# EAGLE schematic EEZ DIB DCP405 r2B5 (EAGLE 7.2.0)
TPS54060 bias, PNP pass (vertical)
Assembly variants: Farnell, TME

## Sheet 1 of 6: Power pre-regulator
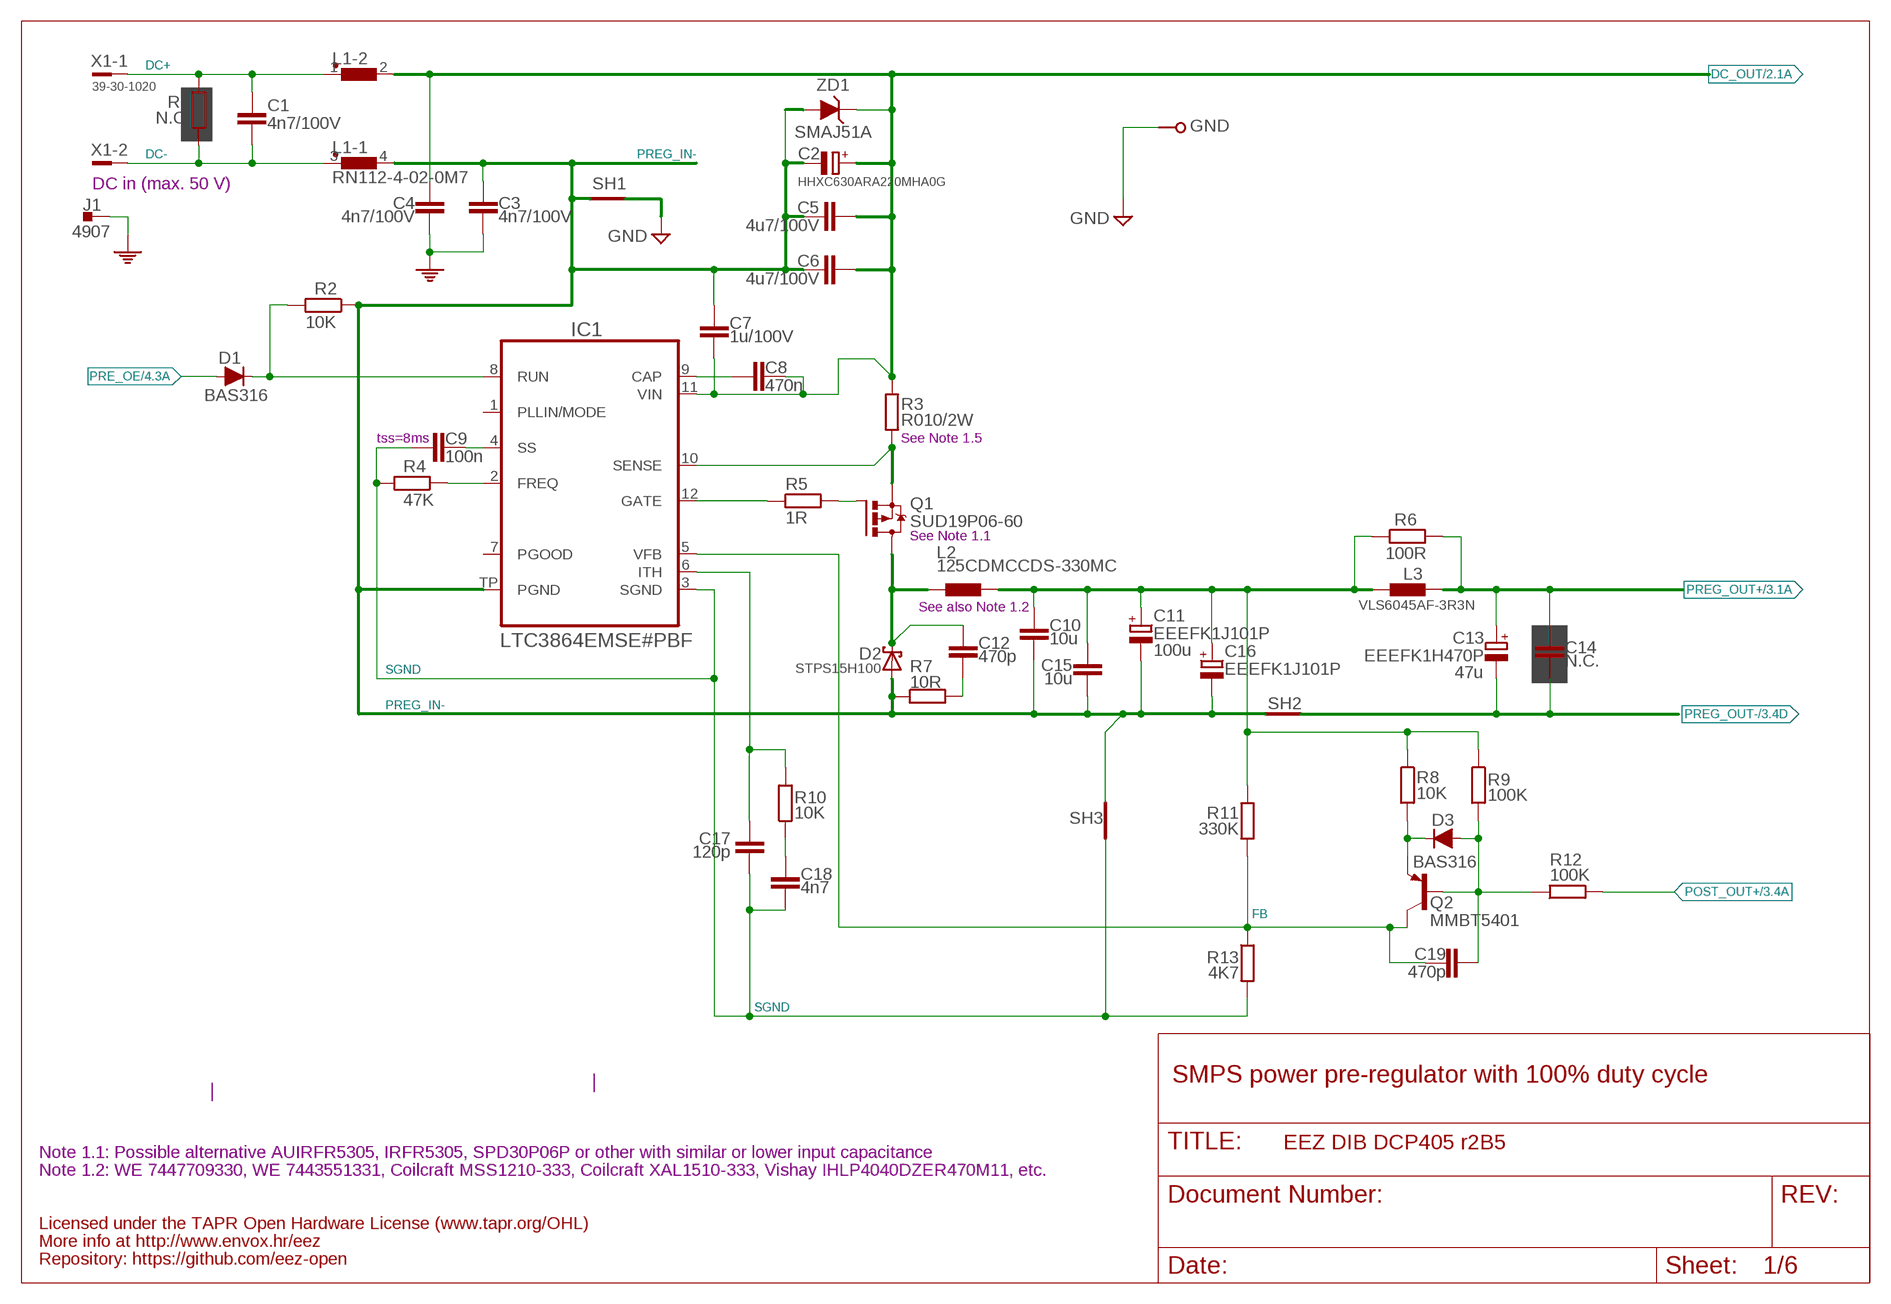
[diagram p0: schematic, sheet 1]

### Parts
C1  4n7/100V  C-EUC1206  [C1206]
C2  HHXC630ARA220MHA0G  ECAPSMD8.3MM/HA0  [CAPAE830X1050N]
C3  4n7/100V  C-EUC1206  [C1206]
C4  4n7/100V  C-EUC1206  [C1206]
C5  4u7/100V  C-EUC1210  [C1210]
C6  4u7/100V  C-EUC1210  [C1210]
C7  1u/100V  C-EUC1206  [C1206]
C8  470n  C-EUC0805  [C0805]
C9  100n  C-EUC0603  [C0603]
C10  10u  C-EUC1210  [C1210]
C11  EEEFK1J101P  ECAP10X10  [CAPAE1030X1050N]
C12  470p  C-EUC0805  [C0805]
C13  EEEFK1H470P  ECAPSMD8.3MM/HA0  [CAPAE830X1050N]
C14  N.C.  C-EUC0805  [C0805]
C15  10u  C-EUC1210  [C1210]
C16  EEEFK1J101P  ECAP10X10  [CAPAE1030X1050N]
C17  120p  C-EUC0805  [C0805]
C18  4n7  C-EUC0805  [C0805]
C19  470p  C-EUC0805  [C0805]
D1  BAS316  DIODESOD323R  [SOD323-R]
D2  STPS15H100  SCHOTTKY-DUAL_A_L  [TO252-L]
D3  BAS316  DIODESOD323R  [SOD323-R]
GND  PCB_TEST_TABSHIELD  [PCB_SHIELD_TAB]
IC1  LTC3864EMSE#PBF  LTC3864  [LTC_05-08-1666]
J1  4907  PCB_TAB-4907  [PCB_TAB-4907]
L1  RN112-4-02-0M7  RN112  [RN112]
L2  125CDMCCDS-330MC  125CDMCC/DS  [125CDMCC/DS]
L3  VLS6045AF-3R3N  COILCRAFT_HPI0630  [COILCRAFT_HPI0630]
Q1  SUD19P06-60  P-MOSFETDPAK  [TO229P990X239-3N]
Q2  MMBT5401  BC857B-PNP-SOT23-BEC  [SOT23-BEC]
R1  N.C.  R-EU_R2512  [R2512]
R2  10K  R-EU_R0805  [R0805]
R3  R010/2W  R-EU_R2512  [R2512]
R4  47K  R-EU_R0805  [R0805]
R5  1R  R-EU_R0805  [R0805]
R6  100R  R-EU_R0805  [R0805]
R7  10R  R-EU_R1206  [R1206]
R8  10K  R-EU_R0805  [R0805]
R9  100K  R-EU_R0805  [R0805]
R10  10K  R-EU_R0805  [R0805]
R11  330K  R-EU_R0805  [R0805]
R12  100K  R-EU_R0805  [R0805]
R13  4K7  R-EU_R0805  [R0805]
SH1  SHORTNOHOLE  [SHORT_NOHOLE]
SH2  Pgnd to Pout- short  SHORTNOHOLE  [SHORT_NOHOLE]
SH3  Sgnd to Pgnd short  SHORTNOHOLE  [SHORT_NOHOLE]
X1  39-30-1020  MINIFIT_39301020  [MINIFIT_39301020]
ZD1  SMAJ51A  P6SMB68A  [DO214AA]

### Nets
DC+: C1.2 L1.1 R1.2 X1.1
DC-: C1.1 L1.3 R1.1 X1.2
DC_OUT: C2.+ C4.2 C5.1 C6.1 C7.1 C8.2 IC1.11(VIN) L1.2 R3.1 ZD1.C ; also sheet 2
FB: C19.1 IC1.5(VFB) Q2.C R11.2 R13.1
GND: GND.1 SH1.2(GND_B) ; also sheet 2,3,4,5,6
L_OUT: C10.1 C11.+ C15.1 C16.+ L2.2 L3.1 R6.1 R8.1 R9.1 R11.1
N$1: D3.C Q2.E R8.2
N$2: C18.1 R10.1
N$7: D1.C IC1.8(RUN) R2.2
N$8: C17.1 IC1.6(ITH) R10.2
N$23: C8.1 IC1.9(CAP)
N$24: IC1.2(FREQ) R4.1
N$27: C9.2 IC1.4(SS)
N$28: Q1.1(G) R5.2
N$30: IC1.12(GATE) R5.1
N$38: C12.2 R7.2
N$79: C19.2 D3.A Q2.B R9.2 R12.1
PE: C3.2 C4.1 J1.1 J1.2 ; also sheet 6
POST_OUT+: R12.2 ; also sheet 3,6
PRE_OE: D1.A ; also sheet 4
PREG_IN-: C2.- C3.1 C5.2 C6.2 C7.2 C10.2 C11.- C15.2 C16.- D2.1(A) D2.2(A) IC1.TP(PGND) L1.4 R2.1 R7.1 SH1.1(GND_A) SH2.2(GND_B) SH3.2(GND_B) ZD1.A
PREG_OUT+: C13.+ C14.1 L3.2 R6.2 ; also sheet 3
PREG_OUT-: C13.- C14.2 SH2.1(GND_A) ; also sheet 3,5
SENSE: IC1.10(SENSE) Q1.3(S) R3.2
SGND: C9.1 C17.2 C18.2 IC1.3(SGND) R4.2 R13.2 SH3.1(GND_A)
SW: C12.1 D2.3(C) L2.1 Q1.2(D)
Unconnected: IC1.1(PLLIN/MODE) IC1.7(PGOOD)

### Notes on the sheet
- DC in (max. 50 V)
- tss=8ms | See Note 1.5
- See Note 1.1
- See also Note 1.2
- 100u
- 47u
- SMPS power pre-regulator with 100% duty cycle
- Note 1.1: Possible alternative AUIRFR5305, IRFR5305, SPD30P06P or other with similar or lower input capacitance
- Note 1.2: WE 7447709330, WE 7443551331, Coilcraft MSS1210-333, Coilcraft XAL1510-333, Vishay IHLP4040DZER470M11, etc.
- Licensed under the TAPR Open Hardware License (www.tapr.org/OHL)
- More info at http://www.envox.hr/eez
- Repository: https://github.com/eez-open

## Sheet 2 of 6: Bias power, DIB interface
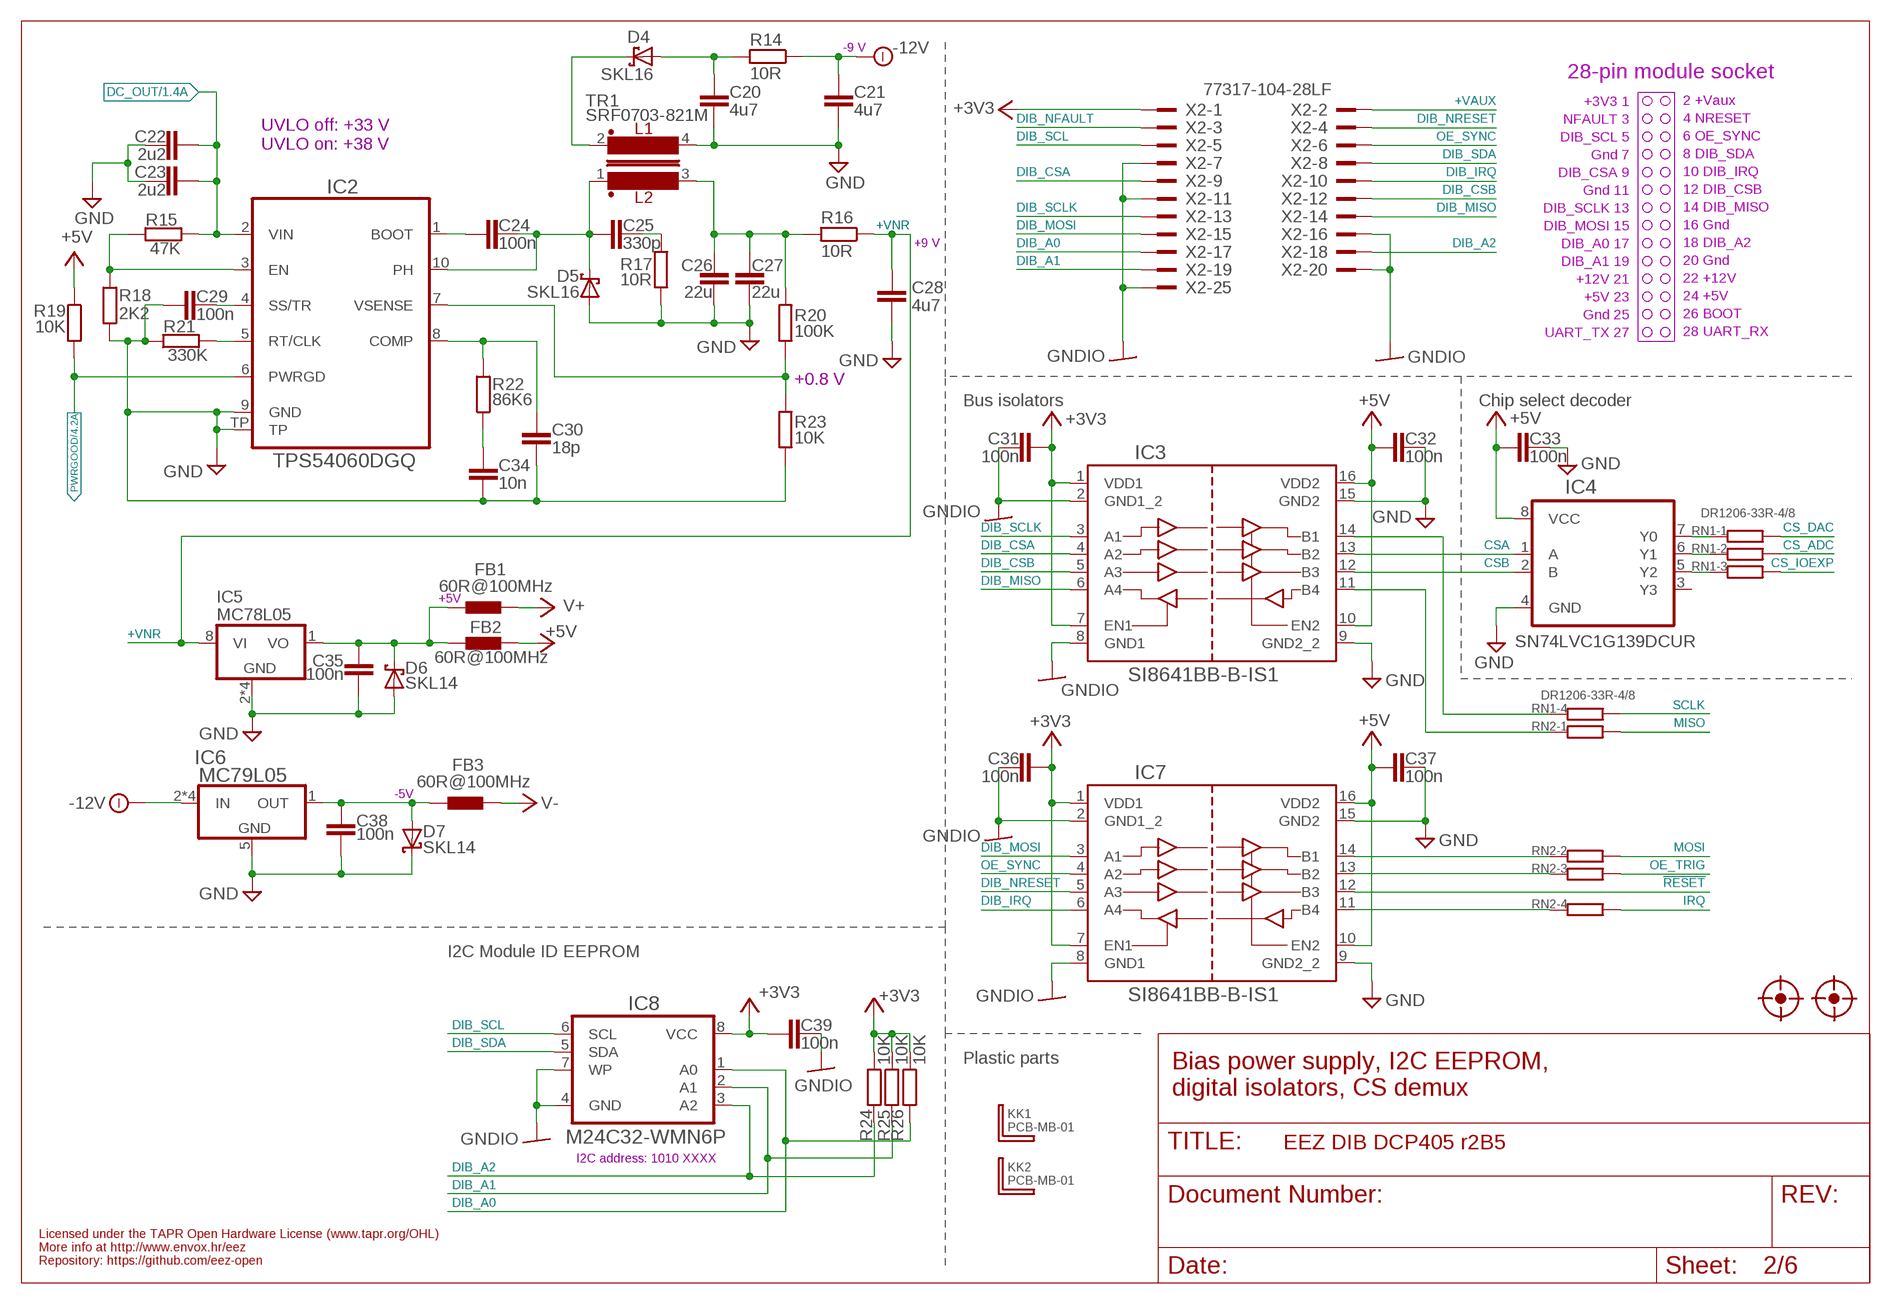
[diagram p1: schematic, sheet 2]

### Parts
C20  4u7  C-EUC1206  [C1206]
C21  4u7  C-EUC1206  [C1206]
C22  2u2  C-EUC1206  [C1206]
C23  2u2  C-EUC1206  [C1206]
C24  100n  C-EUC0603  [C0603]
C25  330p  C-EUC0805  [C0805]
C26  22u  C-EUC1206  [C1206]
C27  22u  C-EUC1206  [C1206]
C28  4u7  C-EUC1206  [C1206]
C29  100n  C-EUC0603  [C0603]
C30  18p  C-EUC0603  [C0603]
C31  100n  C-EUC0603  [C0603]
C32  100n  C-EUC0603  [C0603]
C33  100n  C-EUC0603  [C0603]
C34  10n  C-EUC0805  [C0805]
C35  100n  C-EUC0603  [C0603]
C36  100n  C-EUC0603  [C0603]
C37  100n  C-EUC0603  [C0603]
C38  100n  C-EUC0603  [C0603]
C39  100n  C-EUC0603  [C0603]
D4  SKL16  SCHOTTKYSOD123  [SOD123]
D5  SKL16  SCHOTTKYSOD123  [SOD123]
D6  SKL14  SCHOTTKYSOD123  [SOD123]
D7  SKL14  SCHOTTKYSOD123  [SOD123]
FB1  60R@100MHz  FERRITE_BEAD0603  [BEAD0603]
FB2  60R@100MHz  FERRITE_BEAD0603  [BEAD0603]
FB3  60R@100MHz  FERRITE_BEAD0603  [BEAD0603]
FM1  FIDUCIAL_2  [FIDUCIAL_DUAL]
FM2  FIDUCIAL_2  [FIDUCIAL_DUAL]
IC2  TPS54060DGQ  [SOP50P490X110-11N]
IC3  SI8641BB-B-IS1  SI8641NSOIC-16  [SOIC-16]
IC4  SN74LVC1G139DCUR  SN74LVC1G139-VSSOP  [DCU8]
IC5  MC78L05  MC78LXXSOIC8  [SOIC127P600X173-8N]
IC6  MC79L05  MC79LXXSOIC  [SOIC127P600X173-8N]
IC7  SI8641BB-B-IS1  SI8641NSOIC-16  [SOIC-16]
IC8  M24C32-WMN6P  AT24CXXSOIC8  [SOIC127P600X173-8N]
KK1  PCB-MB-01  PCB-MB  [PCB-MB]
KK2  PCB-MB-01  PCB-MB  [PCB-MB]
R14  10R  R-EU_R1206  [R1206]
R15  47K  R-EU_R0805  [R0805]
R16  10R  R-EU_R1206  [R1206]
R17  10R  R-EU_R1206  [R1206]
R18  2K2  R-EU_R0805  [R0805]
R19  10K  R-EU_R0805  [R0805]
R20  100K  R-EU_R0805  [R0805]
R21  330K  R-EU_R0805  [R0805]
R22  86K6  R-EU_R0805  [R0805]
R23  10K  R-EU_R0805  [R0805]
R24  10K  R-EU_R0805  [R0805]
R25  10K  R-EU_R0805  [R0805]
R26  10K  R-EU_R0805  [R0805]
RN1  DR1206-33R-4/8  R_ARRAY4  [CAY16]
RN2  DR1206-33R-4/8  R_ARRAY4  [CAY16]
TR1  SRF0703-821M  BOURNS_SRF0703INV  [SRF0703]
X2  77317-104-28LF  [77317-104-28LF]

### Nets
!RESET: IC7.12(B3) ; also sheet 4
+3V3: C31.1 C36.1 C39.2 IC3.1(VDD1) IC3.7(EN1) IC7.1(VDD1) IC7.7(EN1) IC8.8(VCC) R24.1 R25.1 R26.1 X2.1
+5V: C32.2 C33.1 C37.2 FB2.P$2 IC3.10(EN2) IC3.16(VDD2) IC4.8(VCC) IC7.10(EN2) IC7.16(VDD2) R19.1 ; also sheet 4,5,6
+5VOUT: C35.1 D6.C FB1.P$1 FB2.P$1 IC5.1(VO)
+VAUX: X2.2
+VNR: C28.1 IC5.8(VI) R16.1
-12V: C21.1 IC6.2(IN) IC6.3(IN) IC6.6(IN) IC6.7(IN) R14.1 ; also sheet 3
CS_ADC: RN1.7 ; also sheet 4
CS_DAC: RN1.8 ; also sheet 4
CS_IOEXP: RN1.6 ; also sheet 4
CSA: IC3.13(B2) IC4.1(A)
CSB: IC3.12(B3) IC4.2(B)
DC_OUT: C22.1 C23.1 IC2.2(VIN) R15.2 ; also sheet 1
DIB_A0: IC8.1(A0) R26.2 X2.17
DIB_A1: IC8.2(A1) R25.2 X2.19
DIB_A2: IC8.3(A2) R24.2 X2.18
DIB_CSA: IC3.4(A2) X2.9
DIB_CSB: IC3.5(A3) X2.12
DIB_IRQ: IC7.6(A4) X2.10
DIB_MISO: IC3.6(A4) X2.14
DIB_MOSI: IC7.3(A1) X2.15
DIB_NFAULT: X2.3
DIB_NRESET: IC7.5(A3) X2.4
DIB_SCL: IC8.6(SCL) X2.5
DIB_SCLK: IC3.3(A1) X2.13
DIB_SDA: IC8.5(SDA) X2.8
GND: C20.2 C21.2 C22.2 C23.2 C26.2 C27.2 C28.2 C29.2 C30.1 C32.1 C33.2 C34.1 C35.2 C37.1 C38.1 D5.A D6.A D7.C IC2.9(GND) IC2.TP IC3.9(GND2_2) IC3.15(GND2) IC4.4(GND) IC5.2(GND) IC5.3(GND) IC5.6(GND) IC5.7(GND) IC6.5(GND) IC7.9(GND2_2) IC7.15(GND2) R17.1 R18.1 R21.1 R23.1 TR1.4 ; also sheet 1,3,4,5,6
GNDIO: C31.2 C36.2 C39.1 IC3.2(GND1_2) IC3.8(GND1) IC7.2(GND1_2) IC7.8(GND1) IC8.4(GND) IC8.7(WP) X2.7 X2.11 X2.16 X2.20 X2.25
IRQ: RN2.5 ; also sheet 4
MISO: RN2.8 ; also sheet 4
MOSI: RN2.7 ; also sheet 4
N$3: IC7.13(B2) RN2.3
N$4: IC4.5(Y2) RN1.3
N$6: IC4.7(Y0) RN1.1
N$9: IC3.11(B4) RN2.1
N$10: IC7.11(B4) RN2.4
N$22: IC4.6(Y1) RN1.2
N$26: C25.2 R17.2
N$29: C38.2 D7.A FB3.P$1 IC6.1(OUT)
N$34: IC2.3(EN) R15.1 R18.2
N$41: C29.1 IC2.4(SS/TR)
N$48: IC2.5(RT/CLK) R21.2
N$50: C30.2 IC2.8(COMP) R22.2
N$51: C34.2 R22.1
N$60: C24.2 IC2.1(BOOT)
N$61: IC7.14(B1) RN2.2
N$62: IC2.7(VSENSE) R20.1 R23.2
N$122: IC3.14(B1) RN1.4
N$179: C20.1 D4.A R14.2
OE_SYNC: IC7.4(A2) X2.6
OE_TRIG: RN2.6 ; also sheet 4
PH: C24.1 C25.1 D5.C IC2.10(PH) TR1.1
PWRGOOD: IC2.6(PWRGD) R19.2 ; also sheet 4
SCLK: RN1.5 ; also sheet 4
V+: FB1.P$2 ; also sheet 3,4,5
V-: FB3.P$2 ; also sheet 3,5
VOUT+: C26.1 C27.1 R16.2 R20.2 TR1.3
VOUT-: D4.C TR1.2
Unconnected: IC4.3(Y3) X2.21 X2.22 X2.23 X2.24 X2.26 X2.27 X2.28

### Notes on the sheet
- -9 V
- 28-pin module socket
- +3V3 1
- 2 +Vaux
- NFAULT 3
- 4 NRESET
- DIB_SCL 5
- 6 OE_SYNC
- UVLO off: +33 V
  UVLO on: +38 V
- Gnd 7
- 8 DIB_SDA
- DIB_CSA 9
- 10 DIB_IRQ
- Gnd 11
- 12 DIB_CSB
- DIB_SCLK 13
- 14 DIB_MISO
- DIB_MOSI 15
- 16 Gnd
- +9 V | DIB_A0 17
- 18 DIB_A2
- DIB_A1 19
- 20 Gnd
- +12V 21
- 22 +12V
- +5V 23
- 24 +5V
- Gnd 25
- 26 BOOT
- UART_TX 27
- 28 UART_RX
- +0.8 V
- Bus isolators | Chip select decoder
- +5V
- -5V
- I2C Module ID EEPROM
- Plastic parts
- Bias power supply, I2C EEPROM,
  digital isolators, CS demux
- I2C address: 1010 XXXX
- Licensed under the TAPR Open Hardware License (www.tapr.org/OHL)
- More info at http://www.envox.hr/eez
- Repository: https://github.com/eez-open

## Sheet 3 of 6: Post-regulator
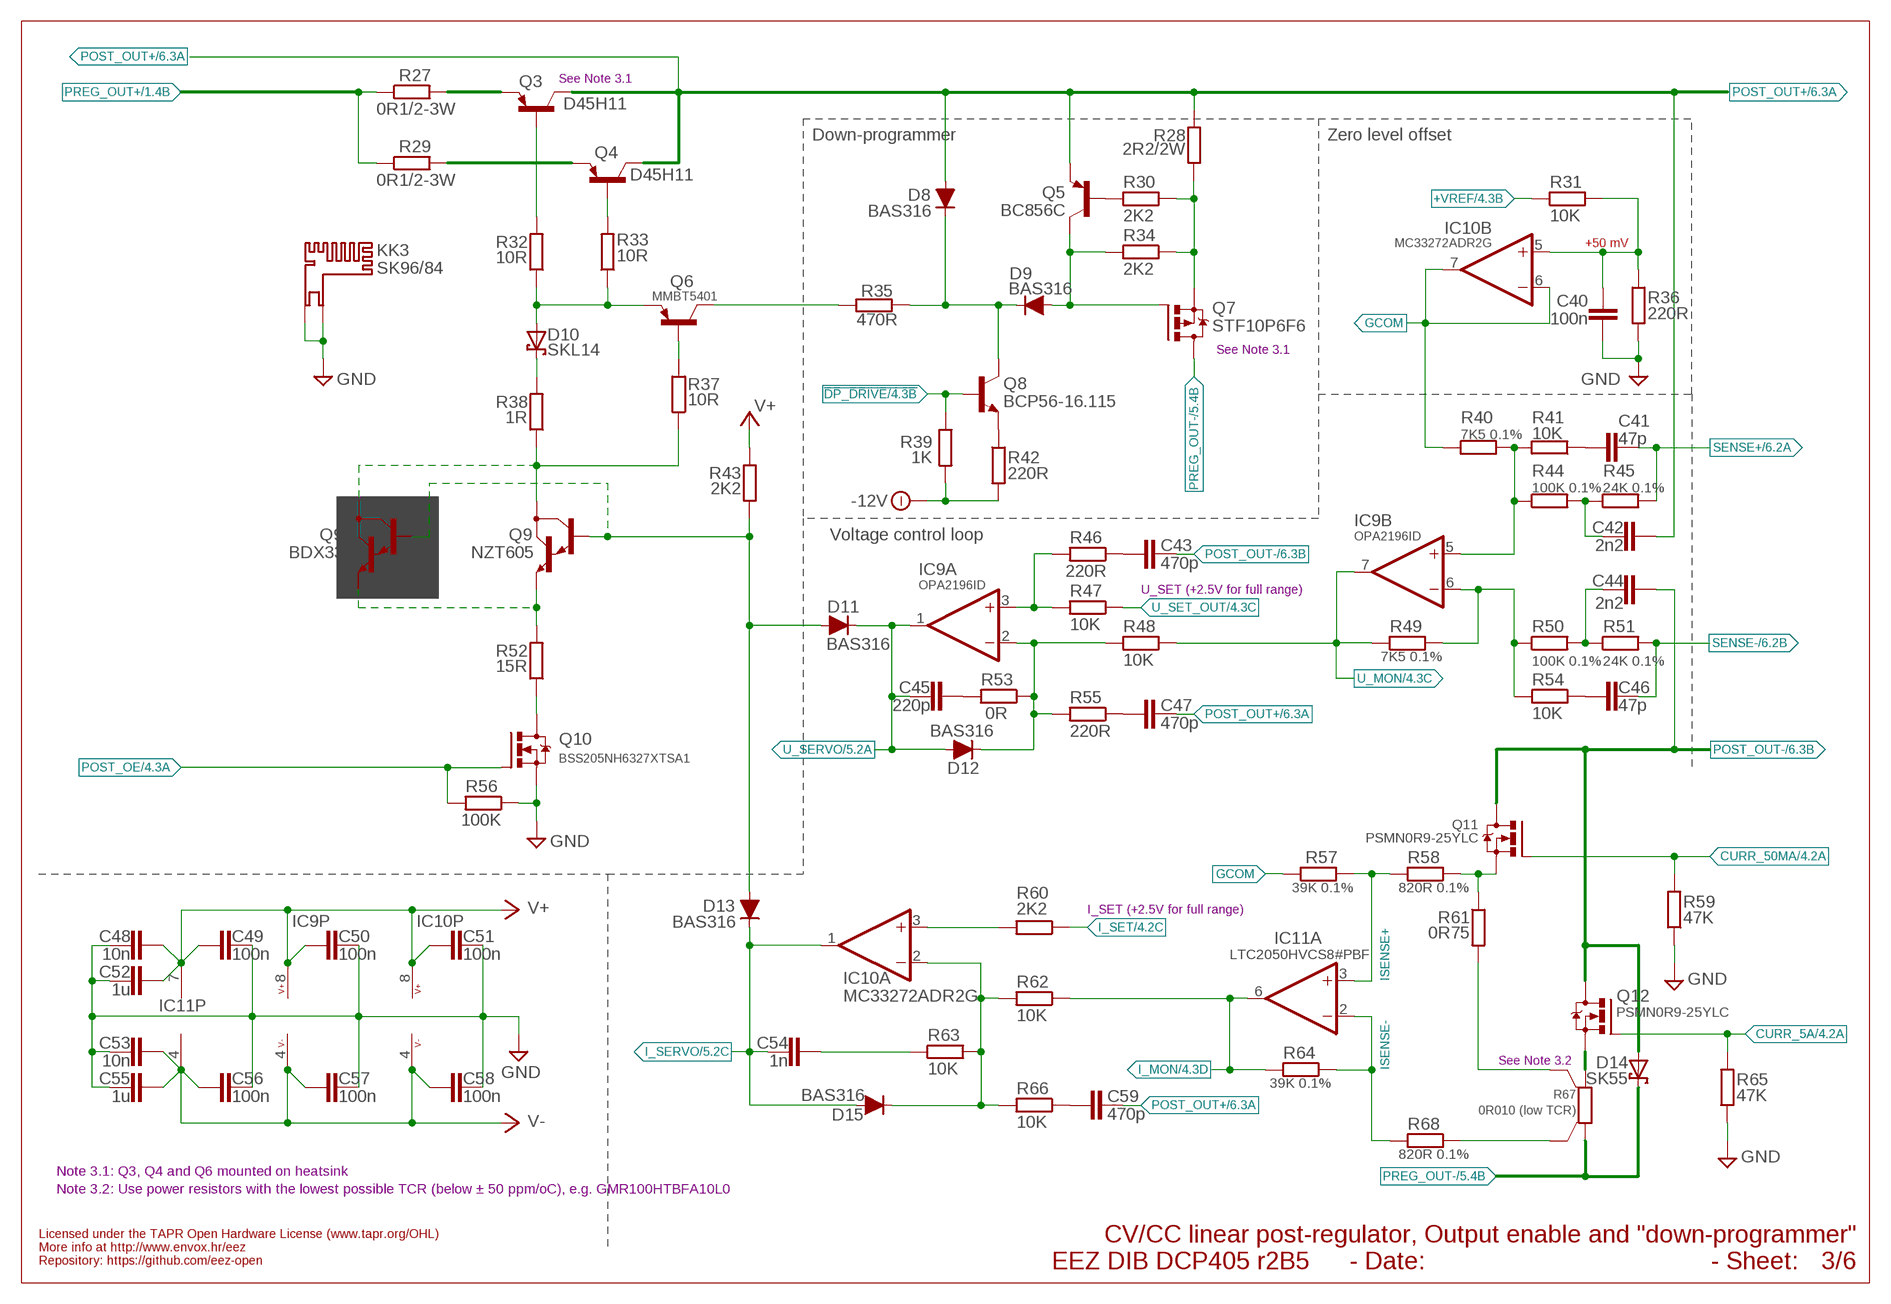
[diagram p2: schematic, sheet 3]

### Parts
C40  100n  C-EUC0603  [C0603]
C41  47p  C-EUC0805  [C0805]
C42  2n2  C-EUC0805  [C0805]
C43  470p  C-EUC0805  [C0805]
C44  2n2  C-EUC0805  [C0805]
C45  220p  C-EUC0805  [C0805]
C46  47p  C-EUC0805  [C0805]
C47  470p  C-EUC0805  [C0805]
C48  10n  C-EUC0805  [C0805]
C49  100n  C-EUC0603  [C0603]
C50  100n  C-EUC0603  [C0603]
C51  100n  C-EUC0603  [C0603]
C52  1u  C-EUC0805  [C0805]
C53  10n  C-EUC0805  [C0805]
C54  1n  C-EUC0805  [C0805]
C55  1u  C-EUC0805  [C0805]
C56  100n  C-EUC0603  [C0603]
C57  100n  C-EUC0603  [C0603]
C58  100n  C-EUC0603  [C0603]
C59  470p  C-EUC0805  [C0805]
D8  BAS316  DIODESOD323R  [SOD323-R]
D9  BAS316  DIODESOD323R  [SOD323-R]
D10  SKL14  SCHOTTKYSOD123  [SOD123]
D11  BAS316  DIODESOD323R  [SOD323-R]
D12  BAS316  DIODESOD323R  [SOD323-R]
D13  BAS316  DIODESOD323R  [SOD323-R]
D14  SK55  SCHOTTKYSMB  [SMB]
D15  BAS316  DIODESOD323R  [SOD323-R]
IC9  OPA2196ID  TL072SOIC8  [SOIC127P600X173-8N]
IC10  MC33272ADR2G  TL072SOIC8  [SOIC127P600X173-8N]
IC11  LTC2050HVCS8#PBF  OP27GSZSO8  [SOIC127P600X173-8N]
KK3  SK96/84  [SK96/84]
Q3  D45H11  D45H11-VERT  [TO220BV]
Q4  D45H11  D45H11-VERT  [TO220BV]
Q5  BC856C  BC857C-PNP-SOT23-BEC  [SOT23-BEC]
Q6  MMBT5401  BC857B-PNP-SOT23-BEC  [SOT23-BEC]
Q7  STF10P6F6  P-MOSFET-VERT  [TO220BV]
Q8  BCP56-16.115  BCP56  [SOT230P700X180-4N]
Q9  NZT605  [SOT230P700X180-4N]
Q9B  BDX33C  [TO220BV]
Q10  BSS205NH6327XTSA1  2N7002  [SOT103P240X110-3N]
Q11  PSMN0R9-25YLC  N-MOSFETLFPAK  [SOT669]
Q12  PSMN0R9-25YLC  N-MOSFETLFPAK  [SOT669]
R27  0R1/2-3W  R-EU_R2512  [R2512]
R28  2R2/2W  R-EU_R2512  [R2512]
R29  0R1/2-3W  R-EU_R2512  [R2512]
R30  2K2  R-EU_R0805  [R0805]
R31  10K  R-EU_R0805  [R0805]
R32  10R  R-EU_R1206  [R1206]
R33  10R  R-EU_R1206  [R1206]
R34  2K2  R-EU_R0805  [R0805]
R35  470R  R-EU_R0805  [R0805]
R36  220R  R-EU_R0805  [R0805]
R37  10R  R-EU_R1206  [R1206]
R38  1R  R-EU_R0805  [R0805]
R39  1K  R-EU_R0805  [R0805]
R40  7K5 0.1%  R-EU_R0805  [R0805]
R41  10K  R-EU_R0805  [R0805]
R42  220R  R-EU_R0805  [R0805]
R43  2K2  R-EU_R0805  [R0805]
R44  100K 0.1%  R-EU_R0805  [R0805]
R45  24K 0.1%  R-EU_R0805  [R0805]
R46  220R  R-EU_R0805  [R0805]
R47  10K  R-EU_R0805  [R0805]
R48  10K  R-EU_R0805  [R0805]
R49  7K5 0.1%  R-EU_R0805  [R0805]
R50  100K 0.1%  R-EU_R0805  [R0805]
R51  24K 0.1%  R-EU_R0805  [R0805]
R52  15R  R-EU_R1206  [R1206]
R53  0R  R-EU_R0805  [R0805]
R54  10K  R-EU_R0805  [R0805]
R55  220R  R-EU_R0805  [R0805]
R56  100K  R-EU_R0805  [R0805]
R57  39K 0.1%  R-EU_R0805  [R0805]
R58  820R 0.1%  R-EU_R0805  [R0805]
R59  47K  R-EU_R0805  [R0805]
R60  2K2  R-EU_R0805  [R0805]
R61  0R75  R-EU_R1206  [R1206]
R62  10K  R-EU_R0805  [R0805]
R63  10K  R-EU_R0805  [R0805]
R64  39K 0.1%  R-EU_R0805  [R0805]
R65  47K  R-EU_R0805  [R0805]
R66  10K  R-EU_R0805  [R0805]
R67  0R010 (low TCR)  R-EU_4WIRE2512  [R_2512-4WIRE]
R68  820R 0.1%  R-EU_R0805  [R0805]

### Nets
5A_S: Q12.1(S) Q12.2(S) Q12.3(S) R67.2
50MA_S: Q11.1(S) Q11.2(S) Q11.3(S) R58.1 R61.1
!DP_DRIVE: Q8.1(B) R39.1 ; also sheet 4
+VREF: R31.1 ; also sheet 4
-12V: R39.2 R42.2 ; also sheet 2
CURR_5A: Q12.4(G) R65.2 ; also sheet 4
CURR_50MA: Q11.4(G) R59.2 ; also sheet 4
DARL_C: Q9.2(C) Q9.4(C) Q9B.2(C) R37.1 R38.1
DP_S: Q7.3(S) R28.1 R30.1 R34.1
GCOM: IC10.6(B:-IN) IC10.7(B:OUT) R40.1 R57.1
GND: C40.2 C48.1 C49.2 C50.1 C51.1 C52.1 C53.1 C55.1 C56.2 C57.1 C58.1 KK3.1 KK3.2 Q10.2(S) R36.2 R56.1 R59.1 R65.1 ; also sheet 1,2,4,5,6
I_MON: IC11.6(A:OUT) R62.1 R64.2 ; also sheet 4
I_SERVO: C54.2 D13.C D15.A IC10.1(A:OUT) ; also sheet 5
I_SET: R60.1 ; also sheet 4
ISENSE+: IC11.3(A:+IN) R57.2 R58.2
ISENSE-: IC11.2(A:-IN) R64.1 R68.2
LOOP_CTRL: D11.A D13.A Q9.1(B) Q9B.1(B) R43.1
N$11: R61.2 R67.2S
N$14: C45.1 R53.2
N$35: Q10.3(D) R52.1
N$37: C54.1 R63.1
N$39: Q6.B R37.2
N$40: Q4.1(B) R33.2
N$42: Q4.3(E) R29.2
N$43: Q3.1(B) R32.2
N$44: D10.A Q6.E R32.1 R33.1
N$45: Q6.C R35.2
N$47: Q9.3(E) Q9B.3(E) R52.2
N$52: D10.C R38.2
N$55: Q3.3(E) R27.2
N$82: IC10.3(A:+IN) R60.2
N$83: IC9.3(A:+IN) R46.2 R47.2
N$84: D12.C IC9.2(A:-IN) R48.2 R53.1 R55.2
N$85: C44.1 R50.2 R51.1
N$86: C41.2 R41.1
N$87: C46.2 R54.1
N$88: C59.2 R66.1
N$89: D15.C IC10.2(A:-IN) R62.2 R63.2 R66.2
N$90: C43.2 R46.1
N$91: C47.2 R55.1
N$98: Q8.3(E) R42.1
N$99: Q5.B R30.2
N$102: C40.1 IC10.5(B:+IN) R31.2 R36.1
N$117: C42.1 R44.2 R45.1
N$147: D9.A Q5.C Q7.1(G) R34.2
N$150: IC9.5(B:+IN) R40.2 R41.2 R44.1
N$158: IC9.6(B:-IN) R49.2 R50.1 R54.2
N$200: R67.1S R68.1
POST_OE: Q10.1(G) R56.2 ; also sheet 4
POST_OUT+: C42.2 C47.1 C59.1 D8.A Q3.2(C) Q4.2(C) Q5.E R28.2 ; also sheet 1,6
POST_OUT-: C43.1 C44.2 D14.A Q11.MB(D) Q12.MB(D) ; also sheet 6
PREG_OUT+: R27.1 R29.1 ; also sheet 1
PREG_OUT-: D14.C Q7.2(D) R67.1 ; also sheet 1,5
Q6C: D8.C D9.C Q8.2(C) Q8.4(C) R35.1
SENSE+: C41.1 R45.2 ; also sheet 6
SENSE-: C46.1 R51.2 ; also sheet 6
U_MON: IC9.7(B:OUT) R48.1 R49.1 ; also sheet 4,5
U_SERVO: C45.2 D11.C D12.A IC9.1(A:OUT) ; also sheet 5
U_SET_OUT: R47.1 ; also sheet 4
V+: C48.2 C49.1 C50.2 C51.2 C52.2 IC9.8(P:V+) IC10.8(P:V+) IC11.7(P:V+) R43.2 ; also sheet 2,4,5
V-: C53.2 C55.2 C56.1 C57.2 C58.2 IC9.4(P:V-) IC10.4(P:V-) IC11.4(P:V-) ; also sheet 2,5

### Notes on the sheet
- See Note 3.1
- Down-programmer | Zero level offset
- +50 mV
- See Note 3.1
- Voltage control loop
- U_SET (+2.5V for full range)
- I_SET (+2.5V for full range)
- See Note 3.2
- Note 3.1: Q3, Q4 and Q6 mounted on heatsink
- Note 3.2: Use power resistors with the lowest possible TCR (below ± 50 ppm/oC), e.g. GMR100HTBFA10L0
- Licensed under the TAPR Open Hardware License (www.tapr.org/OHL)
- CV/CC linear post-regulator, Output enable and "down-programmer"
- More info at http://www.envox.hr/eez
- Repository: https://github.com/eez-open
- - Date: | - Sheet:

## Sheet 4 of 6: Digital control, Vref
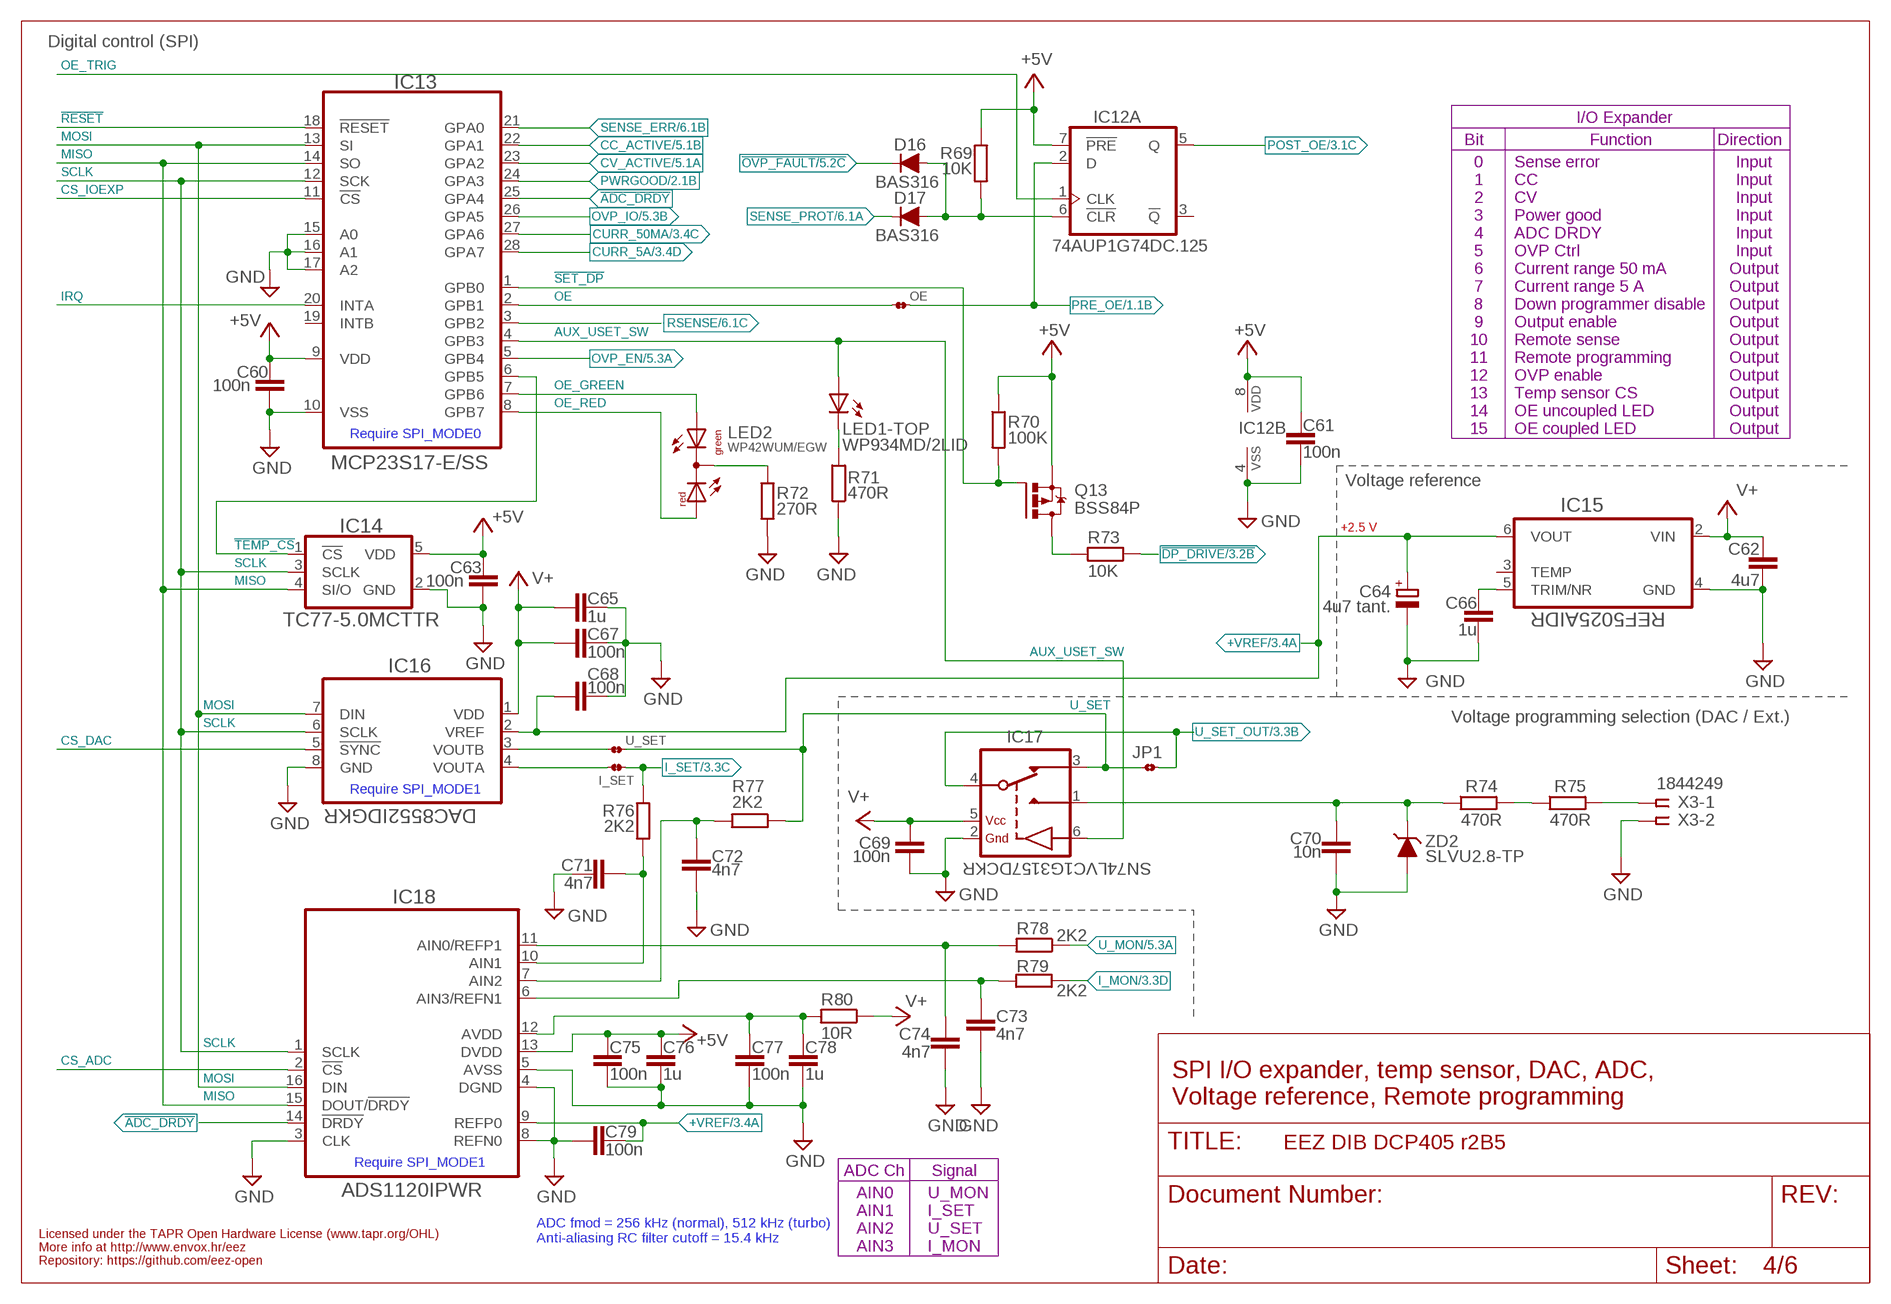
[diagram p3: schematic, sheet 4]

### Parts
C60  100n  C-EUC0603  [C0603]
C61  100n  C-EUC0603  [C0603]
C62  4u7  C-EUC1206  [C1206]
C63  100n  C-EUC0603  [C0603]
C64  4u7 tant.  ECAP1206  [EC1206]
C65  1u  C-EUC0805  [C0805]
C66  1u  C-EUC0805  [C0805]
C67  100n  C-EUC0603  [C0603]
C68  100n  C-EUC0603  [C0603]
C69  100n  C-EUC0603  [C0603]
C70  10n  C-EUC0805  [C0805]
C71  4n7  C-EUC0805  [C0805]
C72  4n7  C-EUC0805  [C0805]
C73  4n7  C-EUC0805  [C0805]
C74  4n7  C-EUC0805  [C0805]
C75  100n  C-EUC0603  [C0603]
C76  1u  C-EUC0805  [C0805]
C77  100n  C-EUC0603  [C0603]
C78  1u  C-EUC0805  [C0805]
C79  100n  C-EUC0603  [C0603]
D16  BAS316  DIODESOD323R  [SOD323-R]
D17  BAS316  DIODESOD323R  [SOD323-R]
I_SET  JP2-NOCUT  [JP2-NOCUT]
IC12  74AUP1G74DC.125  SN74LVC1G74DCTR-VSSOP  [DCU8]
IC13  MCP23S17-E/SS  MCP23S17-E/SSSSOP  [SOP65P780X200-28N]
IC14  TC77-5.0MCTTR  TC77  [SOT23-5]
IC15  REF5025AIDR  REF50XX  [SOIC127P600X175-8N]
IC16  DAC8552IDGKR  DAC8552_DGK_8M  [DGK8-M]
IC17  SN74LVC1G3157DCKR  SN74LVC1G3157-DCK  [SOT65P210X110-6N]
IC18  ADS1120IPWR  ADS1120TSSOP-16  [PW(R-PDSO-G16)]
JP1  JP2-CUT  [JP2-CUT]
LED1  WP934MD/2LID  [WP934MD]
LED2  WP42WUM/EGW  LED_L-42WUM/1EGWT  [L-42WUM-1EGWT]
OE  JP2-NOCUT  [JP2-NOCUT]
Q13  BSS84P  IRLML2246TRPBF  [SOT95P237X112-3N]
R69  10K  R-EU_R0805  [R0805]
R70  100K  R-EU_R0805  [R0805]
R71  470R  R-EU_R0805  [R0805]
R72  270R  R-EU_R0805  [R0805]
R73  10K  R-EU_R0805  [R0805]
R74  470R  R-EU_R0805  [R0805]
R75  470R  R-EU_R0805  [R0805]
R76  2K2  R-EU_R0805  [R0805]
R77  2K2  R-EU_R0805  [R0805]
R78  2K2  R-EU_R0805  [R0805]
R79  2K2  R-EU_R0805  [R0805]
R80  10R  R-EU_R1206  [R1206]
U_SET  JP2-NOCUT  [JP2-NOCUT]
X3  1844249  MC1,5/5-G-3,5  [MC1,5/5-G-3,5]
ZD2  SLVU2.8-TP  SLVU2.8  [SOT23]

### Nets
!ADC_DRDY: IC13.25(GPA4) IC18.14(!DRDY)
!DP_DRIVE: R73.1 ; also sheet 3
!OVP_FAULT: D16.C ; also sheet 5
!RESET: IC13.18(!RESET) ; also sheet 2
!SET_DP: IC13.1(GPB0) Q13.1(G) R70.2
!TEMP_CS: IC13.6(GPB5) IC14.1(!CS)
+5V: C60.1 C61.2 C63.1 C75.2 C76.2 IC12.7(A:!PRE) IC12.8(B:VDD) IC13.9(VDD) IC14.5(VDD) IC18.13(DVDD) Q13.2(S) R69.1 R70.1 ; also sheet 2,5,6
+VREF: C64.+ C68.2 C79.2 IC15.6(VOUT) IC16.2(VREF) IC18.9(REFP0) ; also sheet 3
AUX_IN: C70.2 IC17.1(NO) R74.1 ZD2.3(C)
AUX_USET_SW: IC13.4(GPB3) IC17.6(CTRL) LED1.TA(-TOP:A)
CC_ACTIVE: IC13.22(GPA1) ; also sheet 5
CS_ADC: IC18.2(!CS) ; also sheet 2
CS_DAC: IC16.5(!SYNC) ; also sheet 2
CS_IOEXP: IC13.11(!CS) ; also sheet 2
CURR_5A: IC13.28(GPA7) ; also sheet 3
CURR_50MA: IC13.27(GPA6) ; also sheet 3
CV_ACTIVE: IC13.23(GPA2) ; also sheet 5
DP_LED: Q13.3(D) R73.2
GND: C60.2 C61.1 C62.2 C63.2 C64.- C65.2 C66.2 C67.1 C68.1 C69.2 C70.1 C71.1 C72.1 C73.2 C74.1 C75.1 C76.1 C77.1 C78.1 C79.1 IC12.4(B:VSS) IC13.10(VSS) IC13.15(A0) IC13.16(A1) IC13.17(A2) IC14.2(GND) IC15.4(GND) IC16.8(GND) IC17.2(GND) IC18.3(CLK) IC18.4(DGND) IC18.5(AVSS) IC18.8(REFN0) R71.1 R72.2 X3.2 ZD2.1(A) ZD2.2(A) ; also sheet 1,2,3,5,6
I_MON: R79.1 ; also sheet 3
I_SET: I_SET.2 R76.1 ; also sheet 3
IRQ: IC13.20(INTA) ; also sheet 2
MISO: IC13.14(SO) IC14.4(SI/O) IC18.15(DOUT/!DRDY) ; also sheet 2
MOSI: IC13.13(SI) IC16.7(DIN) IC18.16(DIN) ; also sheet 2
N$12: LED2.CC(C) R72.1
N$16: I_SET.1 IC16.4(VOUTA)
N$17: R74.2 R75.1
N$32: R75.2 X3.1
N$36: IC16.3(VOUTB) U_SET.1
N$56: D16.A D17.A IC12.6(A:!CLR) R69.2
N$70: C77.2 C78.2 IC18.12(AVDD) R80.2
N$71: C66.1 IC15.5(TRIM/NR)
N$72: C71.2 IC18.10(AIN1) R76.2
N$73: C74.2 IC18.11(AIN0/REFP1) R78.2
N$80: C72.2 IC18.7(AIN2) R77.2
N$81: C73.1 IC18.6(AIN3/REFN1) R79.2
N$121: LED1.TC(-TOP:C) R71.2
OE: IC13.2(GPB1) OE.1
OE_GREEN: IC13.7(GPB6) LED2.GREEN(AG)
OE_RED: IC13.8(GPB7) LED2.RED(AR)
OE_TRIG: IC12.1(A:CLK) ; also sheet 2
OVP_EN: IC13.5(GPB4) ; also sheet 5
OVP_IO: IC13.26(GPA5) ; also sheet 5
POST_OE: IC12.5(A:Q) ; also sheet 3
PRE_OE: IC12.2(A:D) OE.2 ; also sheet 1
PWRGOOD: IC13.24(GPA3) ; also sheet 2
RSENSE: IC13.3(GPB2) ; also sheet 6
SCLK: IC13.12(SCK) IC14.3(SCLK) IC16.6(SCLK) IC18.1(SCLK) ; also sheet 2
SENSE_ERR: IC13.21(GPA0) ; also sheet 6
SENSE_PROT: D17.C ; also sheet 6
U_MON: R78.1 ; also sheet 3,5
U_SET: IC17.3(NC) JP1.1 R77.1 U_SET.2 ; also sheet 5
U_SET_OUT: IC17.4(COM) JP1.2 ; also sheet 3
V+: C62.1 C65.1 C67.2 C69.1 IC15.2(VIN) IC16.1(VDD) IC17.5(VDD) R80.1 ; also sheet 2,3,5
Unconnected: IC12.3(A:!Q) IC13.19(INTB) IC15.3(TEMP)

### Notes on the sheet
- Digital control (SPI)
- I/O Expander
- Bit | Function | Direction
- 0 | Sense error | Input
- 1 | CC | Input
- 2 | CV | Input
- 3 | Power good | Input
- 4 | ADC DRDY | Input
- 5 | OVP Ctrl | Input
- 6 | Current range 50 mA | Output
- 7 | Current range 5 A | Output
- 8 | Down programmer disable | Output
- 9 | Output enable | Output
- 10 | Remote sense | Output
- 11 | Remote programming | Output
- 12 | OVP enable | Output
- 13 | Temp sensor CS | Output
- 14 | OE uncoupled LED | Output
- 15 | OE coupled LED | Output
- Require SPI_MODE0
- Voltage reference
- +2.5 V
- Voltage programming selection (DAC / Ext.)
- Require SPI_MODE1
- SPI I/O expander, temp sensor, DAC, ADC, 
  Voltage reference, Remote programming
- Require SPI_MODE1
- ADC Ch | Signal
- AIN0 | U_MON
- AIN1 | I_SET
- AIN2 | U_SET
- Licensed under the TAPR Open Hardware License (www.tapr.org/OHL)
- ADC fmod = 256 kHz (normal), 512 kHz (turbo)
  Anti-aliasing RC filter cutoff = 15.4 kHz
- More info at http://www.envox.hr/eez | AIN3 | I_MON
- Repository: https://github.com/eez-open

## Sheet 5 of 6: CC/CV, OVP
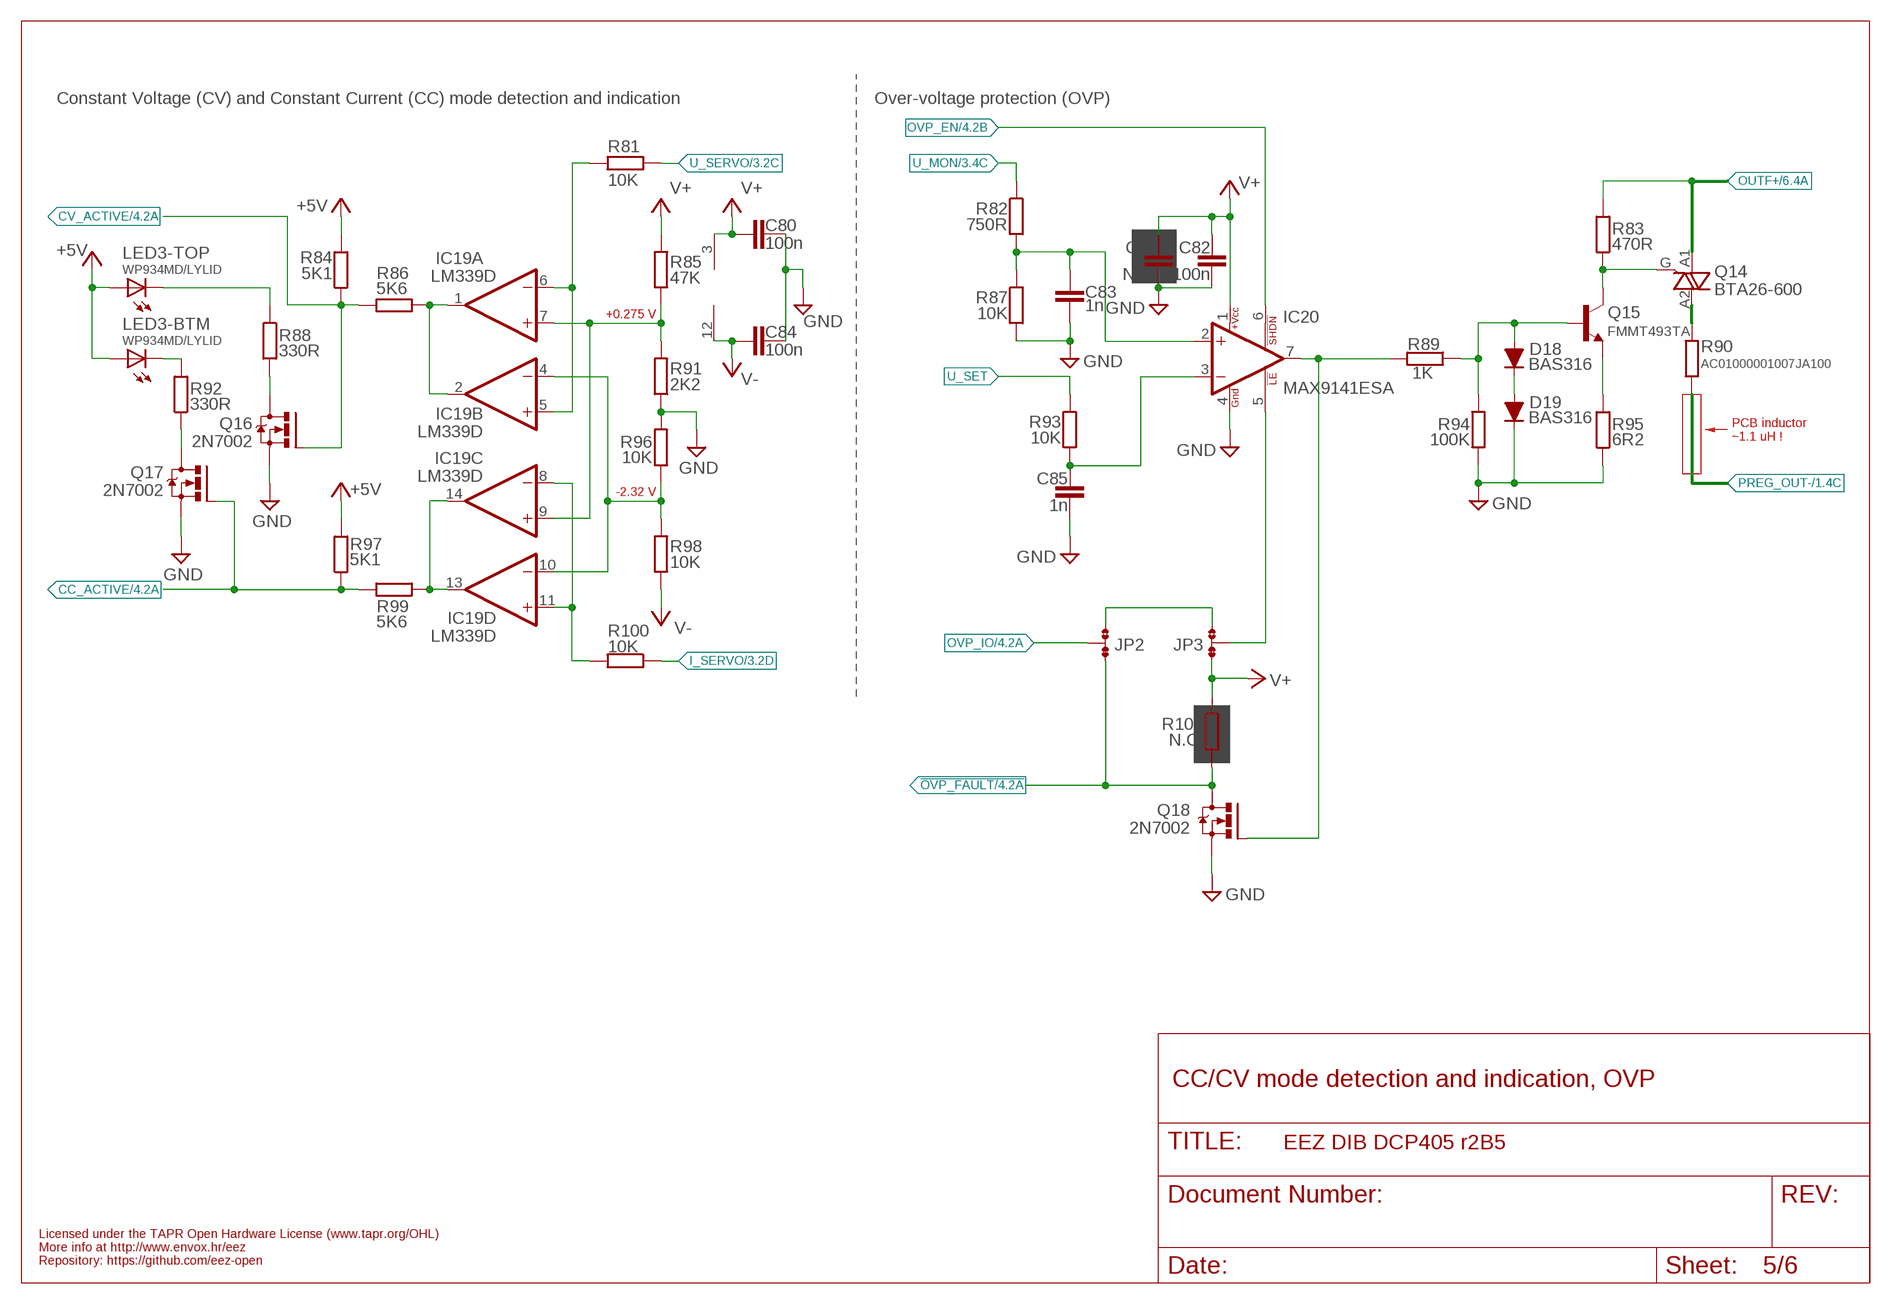
[diagram p4: schematic, sheet 5]

### Parts
C80  100n  C-EUC0603  [C0603]
C81  N.C.  C-EUC0805  [C0805]
C82  100n  C-EUC0603  [C0603]
C83  1n  C-EUC0805  [C0805]
C84  100n  C-EUC0603  [C0603]
C85  1n  C-EUC0805  [C0805]
D18  BAS316  DIODESOD323R  [SOD323-R]
D19  BAS316  DIODESOD323R  [SOD323-R]
IC19  LM339D  LM339SO14  [SOIC127P600X175-14N]
IC20  MAX9141ESA  [SOIC127P600X173-8N]
JP2  JP3-CUT-ROTATED  [JP3-CUT2]
JP3  JP3-CUT  [JP3-CUT]
LED3  WP934MD/LYLID  [WP934MD]
Q14  BTA26-600  BTA41-2  [TOP3_TRIAC_NOHOLE]
Q15  FMMT493TA  MMBT5551LT1-NPN-SOT23-BEC  [SOT23-BEC]
Q16  2N7002  [SOT103P240X110-3N]
Q17  2N7002  [SOT103P240X110-3N]
Q18  2N7002  [SOT103P240X110-3N]
R81  10K  R-EU_R0805  [R0805]
R82  750R  R-EU_R0805  [R0805]
R83  470R  R-EU_R0805  [R0805]
R84  5K1  R-EU_R0805  [R0805]
R85  47K  R-EU_R0805  [R0805]
R86  5K6  R-EU_R0805  [R0805]
R87  10K  R-EU_R0805  [R0805]
R88  330R  R-EU_R0805  [R0805]
R89  1K  R-EU_R0805  [R0805]
R90  AC01000001007JA100  R-EU_0411/15  [0411/15]
R91  2K2  R-EU_R0805  [R0805]
R92  330R  R-EU_R0805  [R0805]
R93  10K  R-EU_R0805  [R0805]
R94  100K  R-EU_R0805  [R0805]
R95  6R2  R-EU_R0805  [R0805]
R96  10K  R-EU_R0805  [R0805]
R97  5K1  R-EU_R0805  [R0805]
R98  10K  R-EU_R0805  [R0805]
R99  5K6  R-EU_R0805  [R0805]
R100  10K  R-EU_R0805  [R0805]
R101  N.C.  R-EU_R0805  [R0805]

### Nets
!OVP_FAULT: JP2.NC Q18.3(D) R101.2 ; also sheet 4
+5V: LED3.BA(-BTM:A) LED3.TA(-TOP:A) R84.2 R97.2 ; also sheet 2,4,6
CC_ACTIVE: Q17.1(G) R97.1 R99.2 ; also sheet 4
CC_LED: LED3.BC(-BTM:C) R92.2
CV_ACTIVE: Q16.1(G) R84.1 R86.2 ; also sheet 4
CV_LED: LED3.TC(-TOP:C) R88.1
GND: C80.1 C81.2 C82.1 C83.1 C84.1 C85.1 D19.C IC20.4(GND) Q16.2(S) Q17.2(S) Q18.2(S) R87.2 R91.1 R94.1 R95.1 R96.2 ; also sheet 1,2,3,4,6
I_SERVO: R100.1 ; also sheet 3
N$13: IC20.7(OUT) Q18.1(G) R89.2
N$15: Q14.A2 R90.2
N$18: Q14.G Q15.C R83.1
N$19: Q15.E R95.2
N$20: D18.C D19.A
N$21: D18.A Q15.B R89.1 R94.2
N$31: C85.2 IC20.3(-IN) R93.2
N$33: C83.2 IC20.2(+IN) R82.2 R87.1
N$46: Q17.3(D) R92.1
N$53: JP2.NO JP3.NO
N$54: IC20.5(!LE) JP3.COM
N$105: IC19.1(A:OUT) IC19.2(B:OUT) R86.1
N$106: IC19.13(D:OUT) IC19.14(C:OUT) R99.1
N$118: Q16.3(D) R88.2
N$153: IC19.5(B:+IN) IC19.6(A:-IN) R81.2
N$161: IC19.8(C:-IN) IC19.11(D:+IN) R100.2
N$170: IC19.7(A:+IN) IC19.9(C:+IN) R85.1 R91.2
N$177: IC19.4(B:-IN) IC19.10(D:-IN) R96.1 R98.2
OUTF+: Q14.A1 R83.2 ; also sheet 6
OVP_EN: IC20.6(!SHDN) ; also sheet 4
OVP_IO: JP2.COM ; also sheet 4
PREG_OUT-: R90.1 ; also sheet 1,3
U_MON: R82.1 ; also sheet 3,4
U_SERVO: R81.1 ; also sheet 3
U_SET: R93.1 ; also sheet 4
V+: C80.2 C81.1 C82.2 IC19.3(P:V+) IC20.1(+VCC) JP3.NC R85.2 R101.1 ; also sheet 2,3,4
V-: C84.2 IC19.12(P:GND) R98.1 ; also sheet 2,3

### Notes on the sheet
- Constant Voltage (CV) and Constant Current (CC) mode detection and indication | Over-voltage protection (OVP)
- +0.275 V
- PCB inductor
  ~1.1 uH !
- -2.32 V
- CC/CV mode detection and indication, OVP
- Licensed under the TAPR Open Hardware License (www.tapr.org/OHL)
- More info at http://www.envox.hr/eez
- Repository: https://github.com/eez-open

## Sheet 6 of 6: Rsense protection, power output
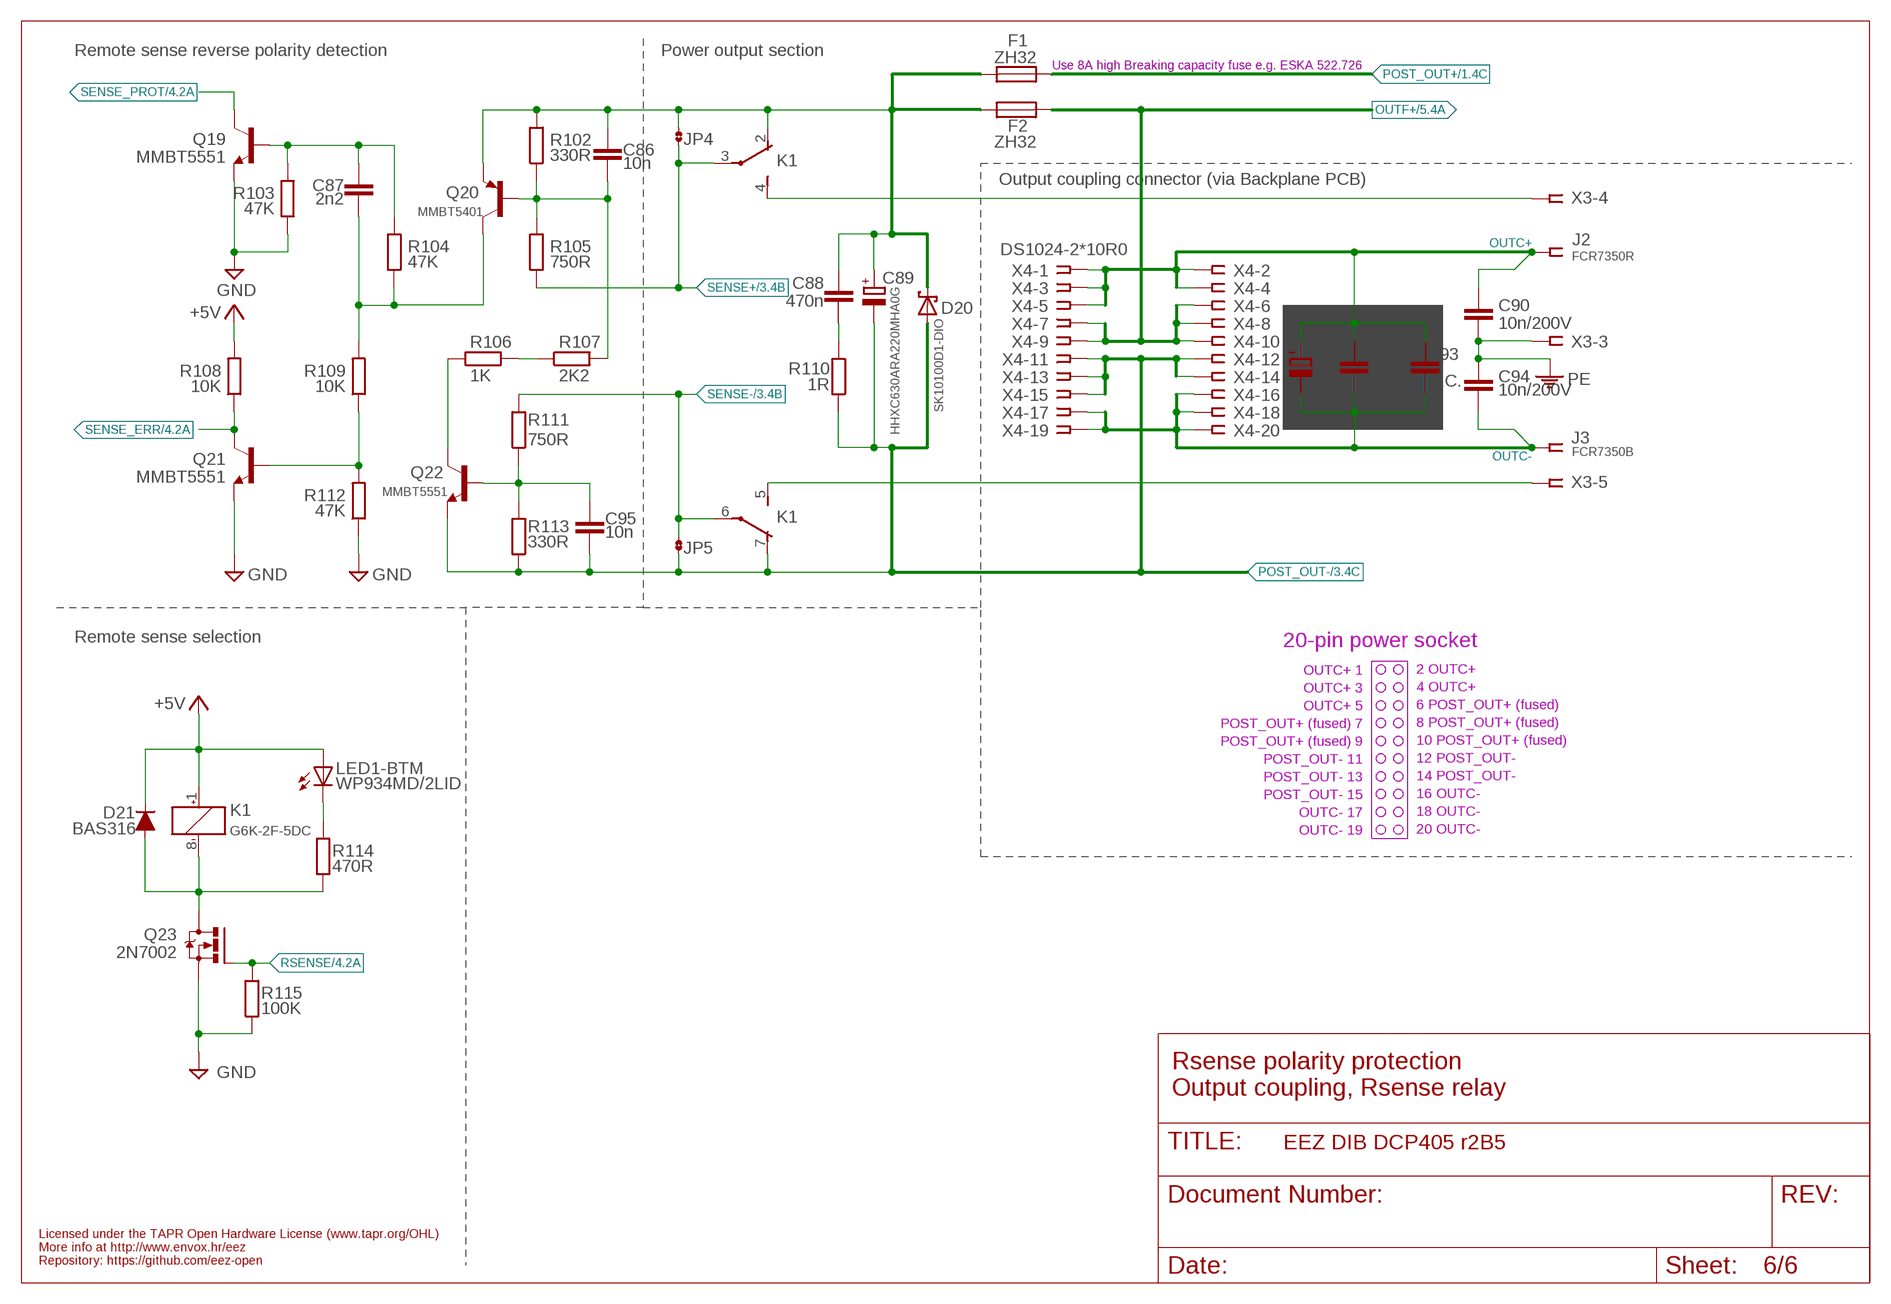
[diagram p5: schematic, sheet 6]

### Parts
C86  10n  C-EUC0805  [C0805]
C87  2n2  C-EUC0805  [C0805]
C88  470n  C-EUC1206  [C1206]
C89  HHXC630ARA220MHA0G  ECAPSMD8.3MM/HA0  [CAPAE830X1050N]
C90  10n/200V  C-EUC1206  [C1206]
C91  N.C.  ECAP2G/5  [ECAP2/5]
C92  N.C.  C-EUC0805  [C0805]
C93  N.C.  C-EUC0805  [C0805]
C94  10n/200V  C-EUC1206  [C1206]
C95  10n  C-EUC0805  [C0805]
D20  SK10100D1-DIO  SCHOTTKY-DUAL_A_L  [TO252-L]
D21  BAS316  DIODESOD323R  [SOD323-R]
F1  ZH32  [ZH32]
F2  ZH32  [ZH32]
J2  FCR7350R  BINDING_POSTCLIFF  [S16N-PC]
J3  FCR7350B  BINDING_POSTCLIFF  [S16N-PC]
JP4  JP2-CUT  [JP2-CUT]
JP5  JP2-CUT  [JP2-CUT]
K1  G6K-2F-5DC  G6K-2F  [G6K-2F]
Q19  MMBT5551  MMBT5551LT1-NPN-SOT23-BEC  [SOT23-BEC]
Q20  MMBT5401  BC857B-PNP-SOT23-BEC  [SOT23-BEC]
Q21  MMBT5551  MMBT5551LT1-NPN-SOT23-BEC  [SOT23-BEC]
Q22  MMBT5551  MMBT5551LT1-NPN-SOT23-BEC  [SOT23-BEC]
Q23  2N7002  [SOT103P240X110-3N]
R102  330R  R-EU_R0805  [R0805]
R103  47K  R-EU_R0805  [R0805]
R104  47K  R-EU_R0805  [R0805]
R105  750R  R-EU_R0805  [R0805]
R106  1K  R-EU_R0805  [R0805]
R107  2K2  R-EU_R0805  [R0805]
R108  10K  R-EU_R0805  [R0805]
R109  10K  R-EU_R0805  [R0805]
R110  1R  R-EU_R0805  [R0805]
R111  750R  R-EU_R0805  [R0805]
R112  47K  R-EU_R0805  [R0805]
R113  330R  R-EU_R0805  [R0805]
R114  470R  R-EU_R0805  [R0805]
R115  100K  R-EU_R0805  [R0805]
X4  DS1024-2*10R0  SSW-110-02-T-D-RA  [SSW-110-02-T-D-RA]

### Nets
+5V: D21.C K1.1(1:+) LED1.BA(-BTM:A) R108.2 ; also sheet 2,4,5
GND: Q19.E Q21.E Q23.2(S) R103.1 R112.1 R115.1 ; also sheet 1,2,3,4,5
N$107: C86.2 Q20.B R102.1 R105.2 R107.2
N$108: C87.2 Q20.C R104.1 R109.2
N$109: Q22.C R106.1
N$110: C95.1 Q22.B R111.1 R113.2
N$111: C87.1 Q19.B R103.2 R104.2
N$112: Q21.B R109.1 R112.2
N$113: C88.2 R110.2
N$114: D21.A K1.8(1:-) Q23.3(D) R114.1
N$115: K1.4(2:S) X3.4
N$116: K1.5(3:S) X3.5
N$120: LED1.BC(-BTM:C) R114.2
N$173: R106.2 R107.1
OUTC+: C90.1 C91.+ C92.1 C93.1 J2.1 J2.NC1 J2.NC2 J2.NC3 J2.NC4 X4.1 X4.2 X4.3 X4.4 X4.5
OUTC-: C91.- C92.2 C93.2 C94.2 J3.1 J3.NC1 J3.NC2 J3.NC3 J3.NC4 X4.16 X4.17 X4.18 X4.19 X4.20
OUTF+: F2.2 X4.6 X4.7 X4.8 X4.9 X4.10 ; also sheet 5
PE: C90.2 C94.1 X3.3 ; also sheet 1
POST_OUT+: F1.1 ; also sheet 1,3
POST_OUT-: C89.- C95.2 D20.1(A) D20.2(A) JP5.1 K1.7(3:O) Q22.E R110.1 R113.1 X4.11 X4.12 X4.13 X4.14 X4.15 ; also sheet 3
POST_OUTF+: C86.1 C88.1 C89.+ D20.3(C) F1.2 F2.1 JP4.2 K1.2(2:O) Q20.E R102.2
RSENSE: Q23.1(G) R115.2 ; also sheet 4
SENSE+: JP4.1 K1.3(2:P) R105.1 ; also sheet 3
SENSE-: JP5.2 K1.6(3:P) R111.2 ; also sheet 3
SENSE_ERR: Q21.C R108.1 ; also sheet 4
SENSE_PROT: Q19.C ; also sheet 4

### Notes on the sheet
- Remote sense reverse polarity detection | Power output section
- Use 8A high Breaking capacity fuse e.g. ESKA 522.726
- Output coupling connector (via Backplane PCB)
- Remote sense selection | 20-pin power socket
- OUTC+ 1
- 2 OUTC+
- OUTC+ 3
- 4 OUTC+
- OUTC+ 5
- 6 POST_OUT+ (fused)
- POST_OUT+ (fused) 7
- 8 POST_OUT+ (fused)
- POST_OUT+ (fused) 9
- 10 POST_OUT+ (fused)
- POST_OUT- 11
- 12 POST_OUT-
- POST_OUT- 13
- 14 POST_OUT-
- POST_OUT- 15
- 16 OUTC-
- OUTC- 17
- 18 OUTC-
- OUTC- 19
- 20 OUTC-
- Rsense polarity protection
  Output coupling, Rsense relay
- Licensed under the TAPR Open Hardware License (www.tapr.org/OHL)
- More info at http://www.envox.hr/eez
- Repository: https://github.com/eez-open

## Library data of the parts
C1 C3-C10 C12 C14 C15 C17-C63 C65-C88 C90 C92-C95 = rcl:C-EU: CAPACITOR, European symbol
C2 C11 C13 C16 C64 C89 C91 = EEZ_Lib1:ECAP
D1 D3 D8 D9 D11-D13 D15-D19 D21 = EEZ_Lib1:DIODE
D2 D4-D7 D10 D14 D20 = EEZ_Lib1:SCHOTTKY
F1 F2 = EEZ_Lib1:ZH32: Fuse holder with cover; tube fuses; 5x20mm
FB1-FB3 = EEZ_Lib1:FERRITE_BEAD: FAIR-RITE - 2506033007Y3 - FERRITE BEAD, 0.04OHM, 3A, 0603 Farnell: 2112873
FM1 FM2 = EEZ_Lib1:FIDUCIAL: Fiducial mark for pick and place automation
GND = EEZ_Lib1:PCB_TEST_TAB
I_SET OE U_SET = EEZ_Lib1:JP2-NOCUT
IC1 = EEZ_Lib1:LTC3864: 60V Low Iq Step-Down DC/DC Controller with 100% Duty Cycle Capability
IC2 = EEZ_Lib1:TPS54060: 0.5A, 60V Step Down SWIFT DC/DC Converter with ECO-MODE,MSOP-10; MPN: TPS54060ADGQ; OC_FARNELL: 2099922; OC_NEWARK: 05W5854; PACKAGE: MSOP-10; SUPPLIER: TEXAS INSTRUMENTS
IC3 IC7 = EEZ_Lib1:SI8641: Low power 4-ch digital isolator (3+1) Farnell: 2423288
IC4 = EEZ_DIB:SN74LVC1G139: 2-to-4 Line Decoder
IC5 = EEZ_Lib1:MC78LXX: μA78L00 series positive voltage regulators
IC6 = EEZ_Lib1:MC79LXX: 3-terminal negative voltage regulator, up to 100mA
IC8 = EEZ_Lib1:AT24CXX: I2C-Compatible (2-wire) Serial EEPROM
IC9 IC10 = EEZ_Lib1:TL072
IC11 = EEZ_Lib1:OP27GSZ: Low Noise, Precision Operational Amplifier
IC12 = EEZ_Lib1:SN74LVC1G74DCTR: Single Positive-Edge-Triggered D-Type Flip-Flop with Clear and Preset
IC13 = EEZ_Lib1:MCP23S17-E/SS: 16-Bit I/O Expander with Serial Interface; FARNELL: 1467675; TME: MCP23S17-E/SS
IC14 = EEZ_Lib1:TC77: Thermal Sensor with SPI Interface
IC15 = EEZ_Lib1:REF50XX: Low-Noise (3μVpp/V), Very Low Drift (max. 8ppm/°C), Precision Voltage Reference Pin compatible with REF2 Farnell: 1439628
IC16 = EEZ_Lib1:DAC8552_DGK_8
IC17 = EEZ_Lib1:SN74LVC1G3157
IC18 = EEZ_Lib1:ADS1120: Low-Power, Low-Noise, 16-Bit, Analog-to-Digital Converter for Small-Signal Sensors Farnell: 2402249
IC19 = EEZ_Lib1:LM339: Low Power Low Offset Voltage Quad Comparators with open collector; LM139/LM239/LM339/LM2901/LM3302
IC20 = EEZ_Lib1:MAX9141: 40ns, Low-Power, 3V/5V, Rail-to-Rail Single-Supply Comparator
J1 = EEZ_connectors:PCB_TAB: PCB quick-fit terminal
J2 J3 = EEZ_Lib1:BINDING_POST: Various 4 mm binding posts
JP1 JP4 JP5 = EEZ_Lib1:JP2-CUT
JP2 JP3 = EEZ_Lib1:JP3-CUT
K1 = relay:G6K: Low Signal Relay oeiwcsnts1.omron.com/.. D20G6K0100.pdf; MF: OMRON COMPONENTS USA; MPN: G6K-2F DC24; OC_FARNELL: 1690427; OC_NEWARK: 36K7467
KK1 KK2 = EEZ_Lib1:PCB-MB: Richo Mounting Block; 16 x 6 mm
KK3 = EEZ_Lib1:SK96/84
L1 = EEZ_Lib1:RN112
L2 = EEZ_inductors_and_transformers:125CDMCC/DS: Sumida SMD power inductor 13.8×12.9×5.0mm
L3 = EEZ_inductors_and_transformers:COILCRAFT_HPI0630: High power inductor
LED1 LED3 = EEZ_Lib1:WP934MD: Kingbright LED; in housing; 3mm; No.of diodes:2
LED2 = EEZ_Lib1:LED_L-42WUM/1EGWT: 3 mm right angle bicolor LED indicator
Q1 Q7 = EEZ_Lib1:P-MOSFET: HEXFET Power MosFet Source: http://www.irf.com/
Q2 Q5 Q6 Q20 = transistor:*-PNP-: PNP Transistror
Q3 Q4 = EEZ_Lib1:D45H11
Q8 = EEZ_Lib1:BCP56: Low power NPN Transistor, Vceo=80V, Ic=1A, SOT-223
Q9 = EEZ_Lib1:NZT605: NPN Darlington Transistor
Q9B = EEZ_Lib1:BDX33C
Q10 Q16-Q18 Q23 = EEZ_Lib1:2N7002: N-CHANNEL ENHANCEMENT MODE FIELD EFFECT TRANSISTOR; MPN: 2N7002-7-F; OC_FARNELL: 1713823; OC_NEWARK: 25R5679; PACKAGE: SOT-23-3; SUPPLIER: DIODES INC.
Q11 Q12 = EEZ_Lib1:N-MOSFET
Q13 = EEZ_Lib1:IRLML2246TRPBF: HEXFET Power MOSFET (-20V, -2.6A); MPN: IRLML2246TRPBF; OC_FARNELL: 1888166; OC_NEWARK: 40T7450; PACKAGE: SOT-3; SUPPLIER: International Rectifier; TME: IRLML2246TRPBF
Q14 = EEZ_Lib1:BTA41: Triac; 40A; 50mA; THT; TOP3
Q15 Q19 Q21 Q22 = transistor:*-NPN-: NPN Transistror BF959 corrected 2008.03.06
R1-R66 R68-R115 = rcl:R-EU_: RESISTOR, European symbol
R67 = EEZ_Lib1:R-EU_4WIRE
RN1 RN2 = EEZ_Lib1:R_ARRAY4: 1206 four resistor array
SH1-SH3 = EEZ_Lib1:SHORT
TR1 = EEZ_inductors_and_transformers:BOURNS_SRF0703INV: Bourns SRF0703 Series - Dual-Winding Shielded Power Inductors
X1 = EEZ_connectors:MINIFIT_39301020: Molex Socket; wire-board; male; Mini-Fit Jr; 4.2mm; PIN:2; THT; PCB snap
X2 = EEZ_connectors:77317-104-28LF: Headers & Wire Housings 28P right angle 0.1" pitch
X3 = EEZ_connectors:MC1,5/5-G-3,5: Pluggable Terminal Blocks 5-pin 3.5mm pitch Through Hole Header
X4 = EEZ_connectors:SSW-110-02-T-D-RA: Samtec SSW-113-02-T-D-RA Receptacle, 2.54MM, RA, 20-way
ZD1 = EEZ_Lib1:P6SMB68A: Transient Voltage Suppression Diodes, DO-214AA
ZD2 = EEZ_Lib1:SLVU2.8: 2.8Volts ESD Protection Devices

## Net classes
0 default: width 0.203 mm, drill 0.3 mm, clearance 0.203 mm
1 lvds: width 0.152 mm, drill 0.3 mm, clearance 0.152 mm to class 0, clearance 0.152 mm
2 gnd: width 0.254 mm, drill 0.584 mm, clearance 0.254 mm